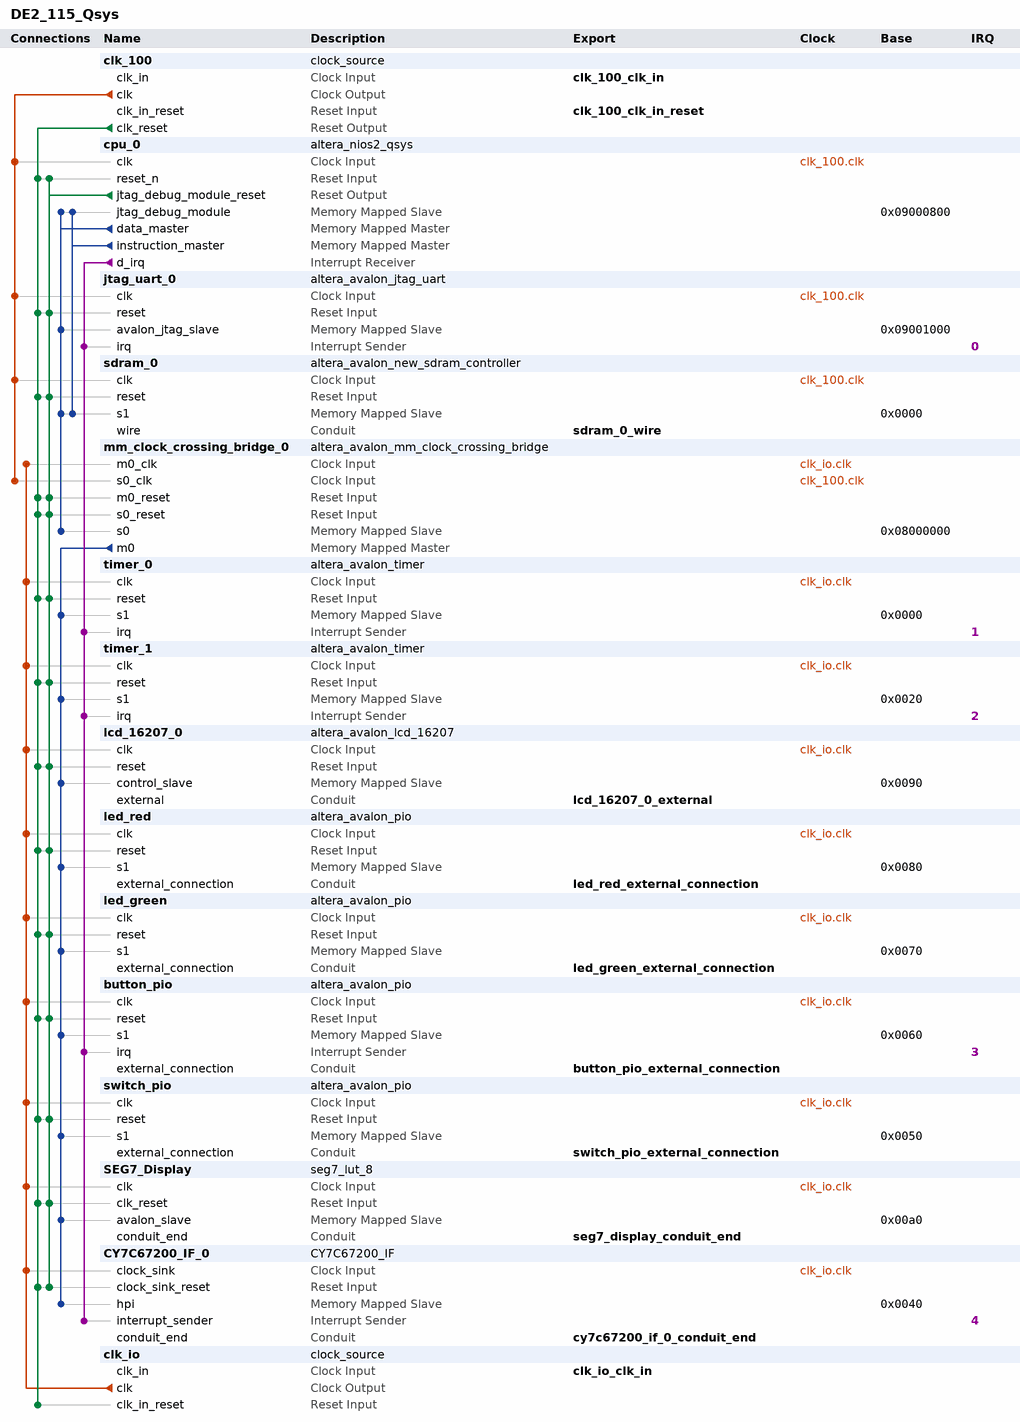
[diagram p0: system contents]
# Platform Designer (Qsys) system DE2_115_Qsys, Cyclone IV E EP2C35F672C6
# Parameters at their usual value, and those the tool derives, are not listed.
package require -exact qsys 12.0
create_system DE2_115_Qsys
set_project_property DEVICE_FAMILY {Cyclone IV E}
set_project_property DEVICE EP2C35F672C6

add_instance clk_100 clock_source 12.0
set_instance_parameter_value clk_100 clockFrequency 100000000

add_instance cpu_0 altera_nios2_qsys 12.0
set_instance_parameter_value cpu_0 manuallyAssignCpuID false
set_instance_parameter_value cpu_0 resetSlave sdram_0.s1
set_instance_parameter_value cpu_0 exceptionSlave sdram_0.s1
set_instance_parameter_value cpu_0 breakSlave cpu_0.jtag_debug_module
set_instance_parameter_value cpu_0 mmu_processIDNumBits 10
set_instance_parameter_value cpu_0 impl Fast
set_instance_parameter_value cpu_0 icache_size 4096
set_instance_parameter_value cpu_0 dcache_size 0
set_instance_parameter_value cpu_0 dcache_lineSize 4

add_instance jtag_uart_0 altera_avalon_jtag_uart 12.0
set_instance_parameter_value jtag_uart_0 simInteractiveOptions INTERACTIVE_ASCII_OUTPUT

add_instance sdram_0 altera_avalon_new_sdram_controller 12.0
set_instance_parameter_value sdram_0 TAC 5.5
set_instance_parameter_value sdram_0 TRCD 20.0
set_instance_parameter_value sdram_0 TRP 20.0
set_instance_parameter_value sdram_0 casLatency 3
set_instance_parameter_value sdram_0 columnWidth 10
set_instance_parameter_value sdram_0 dataWidth 32
set_instance_parameter_value sdram_0 generateSimulationModel true
set_instance_parameter_value sdram_0 model custom
set_instance_parameter_value sdram_0 numberOfBanks 4
set_instance_parameter_value sdram_0 numberOfChipSelects 1
set_instance_parameter_value sdram_0 powerUpDelay 100.0
set_instance_parameter_value sdram_0 refreshPeriod 15.625
set_instance_parameter_value sdram_0 rowWidth 13

add_instance mm_clock_crossing_bridge_0 altera_avalon_mm_clock_crossing_bridge 12.0
set_instance_parameter_value mm_clock_crossing_bridge_0 DATA_WIDTH 32
set_instance_parameter_value mm_clock_crossing_bridge_0 ADDRESS_WIDTH 10
set_instance_parameter_value mm_clock_crossing_bridge_0 MAX_BURST_SIZE 1
set_instance_parameter_value mm_clock_crossing_bridge_0 COMMAND_FIFO_DEPTH 4
set_instance_parameter_value mm_clock_crossing_bridge_0 RESPONSE_FIFO_DEPTH 4
set_instance_parameter_value mm_clock_crossing_bridge_0 MASTER_SYNC_DEPTH 2
set_instance_parameter_value mm_clock_crossing_bridge_0 SLAVE_SYNC_DEPTH 2

add_instance timer_0 altera_avalon_timer 12.0
set_instance_parameter_value timer_0 period 1
set_instance_parameter_value timer_0 periodUnits MSEC
set_instance_parameter_value timer_0 timerPreset CUSTOM

add_instance timer_1 altera_avalon_timer 12.0
set_instance_parameter_value timer_1 period 1
set_instance_parameter_value timer_1 periodUnits MSEC
set_instance_parameter_value timer_1 timerPreset CUSTOM

add_instance lcd_16207_0 altera_avalon_lcd_16207 12.0

add_instance led_red altera_avalon_pio 12.0
set_instance_parameter_value led_red direction Output
set_instance_parameter_value led_red width 18

add_instance led_green altera_avalon_pio 12.0
set_instance_parameter_value led_green direction Output
set_instance_parameter_value led_green width 9

add_instance button_pio altera_avalon_pio 12.0
set_instance_parameter_value button_pio captureEdge true
set_instance_parameter_value button_pio direction Input
set_instance_parameter_value button_pio edgeType FALLING
set_instance_parameter_value button_pio generateIRQ true
set_instance_parameter_value button_pio irqType EDGE
set_instance_parameter_value button_pio simDoTestBenchWiring true
set_instance_parameter_value button_pio width 4

add_instance switch_pio altera_avalon_pio 12.0
set_instance_parameter_value switch_pio direction Input
set_instance_parameter_value switch_pio simDoTestBenchWiring true
set_instance_parameter_value switch_pio width 18

add_instance SEG7_Display seg7_lut_8 1.0.1

add_instance CY7C67200_IF_0 CY7C67200_IF 1.0

add_instance clk_io clock_source 12.0
set_instance_parameter_value clk_io clockFrequency 12000000

# connections
add_connection clk_100.clk cpu_0.clk clock
add_connection clk_100.clk jtag_uart_0.clk clock
add_connection clk_100.clk mm_clock_crossing_bridge_0.s0_clk clock
add_connection clk_100.clk sdram_0.clk clock
add_connection clk_io.clk button_pio.clk clock
add_connection clk_io.clk CY7C67200_IF_0.clock_sink clock
add_connection clk_io.clk lcd_16207_0.clk clock
add_connection clk_io.clk led_green.clk clock
add_connection clk_io.clk led_red.clk clock
add_connection clk_io.clk mm_clock_crossing_bridge_0.m0_clk clock
add_connection clk_io.clk SEG7_Display.clk clock
add_connection clk_io.clk switch_pio.clk clock
add_connection clk_io.clk timer_0.clk clock
add_connection clk_io.clk timer_1.clk clock
add_connection clk_100.clk_reset button_pio.reset reset
add_connection clk_100.clk_reset clk_io.clk_in_reset reset
add_connection clk_100.clk_reset cpu_0.reset_n reset
add_connection clk_100.clk_reset CY7C67200_IF_0.clock_sink_reset reset
add_connection clk_100.clk_reset jtag_uart_0.reset reset
add_connection clk_100.clk_reset lcd_16207_0.reset reset
add_connection clk_100.clk_reset led_green.reset reset
add_connection clk_100.clk_reset led_red.reset reset
add_connection clk_100.clk_reset mm_clock_crossing_bridge_0.m0_reset reset
add_connection clk_100.clk_reset mm_clock_crossing_bridge_0.s0_reset reset
add_connection clk_100.clk_reset sdram_0.reset reset
add_connection clk_100.clk_reset SEG7_Display.clk_reset reset
add_connection clk_100.clk_reset switch_pio.reset reset
add_connection clk_100.clk_reset timer_0.reset reset
add_connection clk_100.clk_reset timer_1.reset reset
add_connection cpu_0.jtag_debug_module_reset button_pio.reset reset
add_connection cpu_0.jtag_debug_module_reset cpu_0.reset_n reset
add_connection cpu_0.jtag_debug_module_reset CY7C67200_IF_0.clock_sink_reset reset
add_connection cpu_0.jtag_debug_module_reset jtag_uart_0.reset reset
add_connection cpu_0.jtag_debug_module_reset lcd_16207_0.reset reset
add_connection cpu_0.jtag_debug_module_reset led_green.reset reset
add_connection cpu_0.jtag_debug_module_reset led_red.reset reset
add_connection cpu_0.jtag_debug_module_reset mm_clock_crossing_bridge_0.m0_reset reset
add_connection cpu_0.jtag_debug_module_reset mm_clock_crossing_bridge_0.s0_reset reset
add_connection cpu_0.jtag_debug_module_reset sdram_0.reset reset
add_connection cpu_0.jtag_debug_module_reset SEG7_Display.clk_reset reset
add_connection cpu_0.jtag_debug_module_reset switch_pio.reset reset
add_connection cpu_0.jtag_debug_module_reset timer_0.reset reset
add_connection cpu_0.jtag_debug_module_reset timer_1.reset reset
add_connection cpu_0.data_master cpu_0.jtag_debug_module avalon
set_connection_parameter_value cpu_0.data_master/cpu_0.jtag_debug_module baseAddress 0x09000800
add_connection cpu_0.data_master jtag_uart_0.avalon_jtag_slave avalon
set_connection_parameter_value cpu_0.data_master/jtag_uart_0.avalon_jtag_slave baseAddress 0x09001000
add_connection cpu_0.data_master mm_clock_crossing_bridge_0.s0 avalon
set_connection_parameter_value cpu_0.data_master/mm_clock_crossing_bridge_0.s0 baseAddress 0x08000000
add_connection cpu_0.data_master sdram_0.s1 avalon
set_connection_parameter_value cpu_0.data_master/sdram_0.s1 baseAddress 0x0000
add_connection cpu_0.instruction_master cpu_0.jtag_debug_module avalon
set_connection_parameter_value cpu_0.instruction_master/cpu_0.jtag_debug_module baseAddress 0x09000800
add_connection cpu_0.instruction_master sdram_0.s1 avalon
set_connection_parameter_value cpu_0.instruction_master/sdram_0.s1 baseAddress 0x0000
add_connection mm_clock_crossing_bridge_0.m0 button_pio.s1 avalon
set_connection_parameter_value mm_clock_crossing_bridge_0.m0/button_pio.s1 baseAddress 0x0060
add_connection mm_clock_crossing_bridge_0.m0 CY7C67200_IF_0.hpi avalon
set_connection_parameter_value mm_clock_crossing_bridge_0.m0/CY7C67200_IF_0.hpi baseAddress 0x0040
add_connection mm_clock_crossing_bridge_0.m0 lcd_16207_0.control_slave avalon
set_connection_parameter_value mm_clock_crossing_bridge_0.m0/lcd_16207_0.control_slave baseAddress 0x0090
add_connection mm_clock_crossing_bridge_0.m0 led_green.s1 avalon
set_connection_parameter_value mm_clock_crossing_bridge_0.m0/led_green.s1 baseAddress 0x0070
add_connection mm_clock_crossing_bridge_0.m0 led_red.s1 avalon
set_connection_parameter_value mm_clock_crossing_bridge_0.m0/led_red.s1 baseAddress 0x0080
add_connection mm_clock_crossing_bridge_0.m0 SEG7_Display.avalon_slave avalon
set_connection_parameter_value mm_clock_crossing_bridge_0.m0/SEG7_Display.avalon_slave baseAddress 0x00a0
add_connection mm_clock_crossing_bridge_0.m0 switch_pio.s1 avalon
set_connection_parameter_value mm_clock_crossing_bridge_0.m0/switch_pio.s1 baseAddress 0x0050
add_connection mm_clock_crossing_bridge_0.m0 timer_0.s1 avalon
set_connection_parameter_value mm_clock_crossing_bridge_0.m0/timer_0.s1 baseAddress 0x0000
add_connection mm_clock_crossing_bridge_0.m0 timer_1.s1 avalon
set_connection_parameter_value mm_clock_crossing_bridge_0.m0/timer_1.s1 baseAddress 0x0020
add_connection cpu_0.d_irq button_pio.irq interrupt
set_connection_parameter_value cpu_0.d_irq/button_pio.irq irqNumber 3
add_connection cpu_0.d_irq CY7C67200_IF_0.interrupt_sender interrupt
set_connection_parameter_value cpu_0.d_irq/CY7C67200_IF_0.interrupt_sender irqNumber 4
add_connection cpu_0.d_irq jtag_uart_0.irq interrupt
set_connection_parameter_value cpu_0.d_irq/jtag_uart_0.irq irqNumber 0
add_connection cpu_0.d_irq timer_0.irq interrupt
set_connection_parameter_value cpu_0.d_irq/timer_0.irq irqNumber 1
add_connection cpu_0.d_irq timer_1.irq interrupt
set_connection_parameter_value cpu_0.d_irq/timer_1.irq irqNumber 2

# exported interfaces
add_interface clk_100_clk_in clock sink
set_interface_property clk_100_clk_in EXPORT_OF clk_100.clk_in
add_interface clk_100_clk_in_reset reset sink
set_interface_property clk_100_clk_in_reset EXPORT_OF clk_100.clk_in_reset
add_interface sdram_0_wire conduit end
set_interface_property sdram_0_wire EXPORT_OF sdram_0.wire
add_interface lcd_16207_0_external conduit end
set_interface_property lcd_16207_0_external EXPORT_OF lcd_16207_0.external
add_interface led_red_external_connection conduit end
set_interface_property led_red_external_connection EXPORT_OF led_red.external_connection
add_interface led_green_external_connection conduit end
set_interface_property led_green_external_connection EXPORT_OF led_green.external_connection
add_interface button_pio_external_connection conduit end
set_interface_property button_pio_external_connection EXPORT_OF button_pio.external_connection
add_interface switch_pio_external_connection conduit end
set_interface_property switch_pio_external_connection EXPORT_OF switch_pio.external_connection
add_interface seg7_display_conduit_end conduit end
set_interface_property seg7_display_conduit_end EXPORT_OF SEG7_Display.conduit_end
add_interface cy7c67200_if_0_conduit_end conduit end
set_interface_property cy7c67200_if_0_conduit_end EXPORT_OF CY7C67200_IF_0.conduit_end
add_interface clk_io_clk_in clock sink
set_interface_property clk_io_clk_in EXPORT_OF clk_io.clk_in

save_system DE2_115_Qsys.qsys
